# Altium schematic sheet Sheet1.SchDoc
size Letter
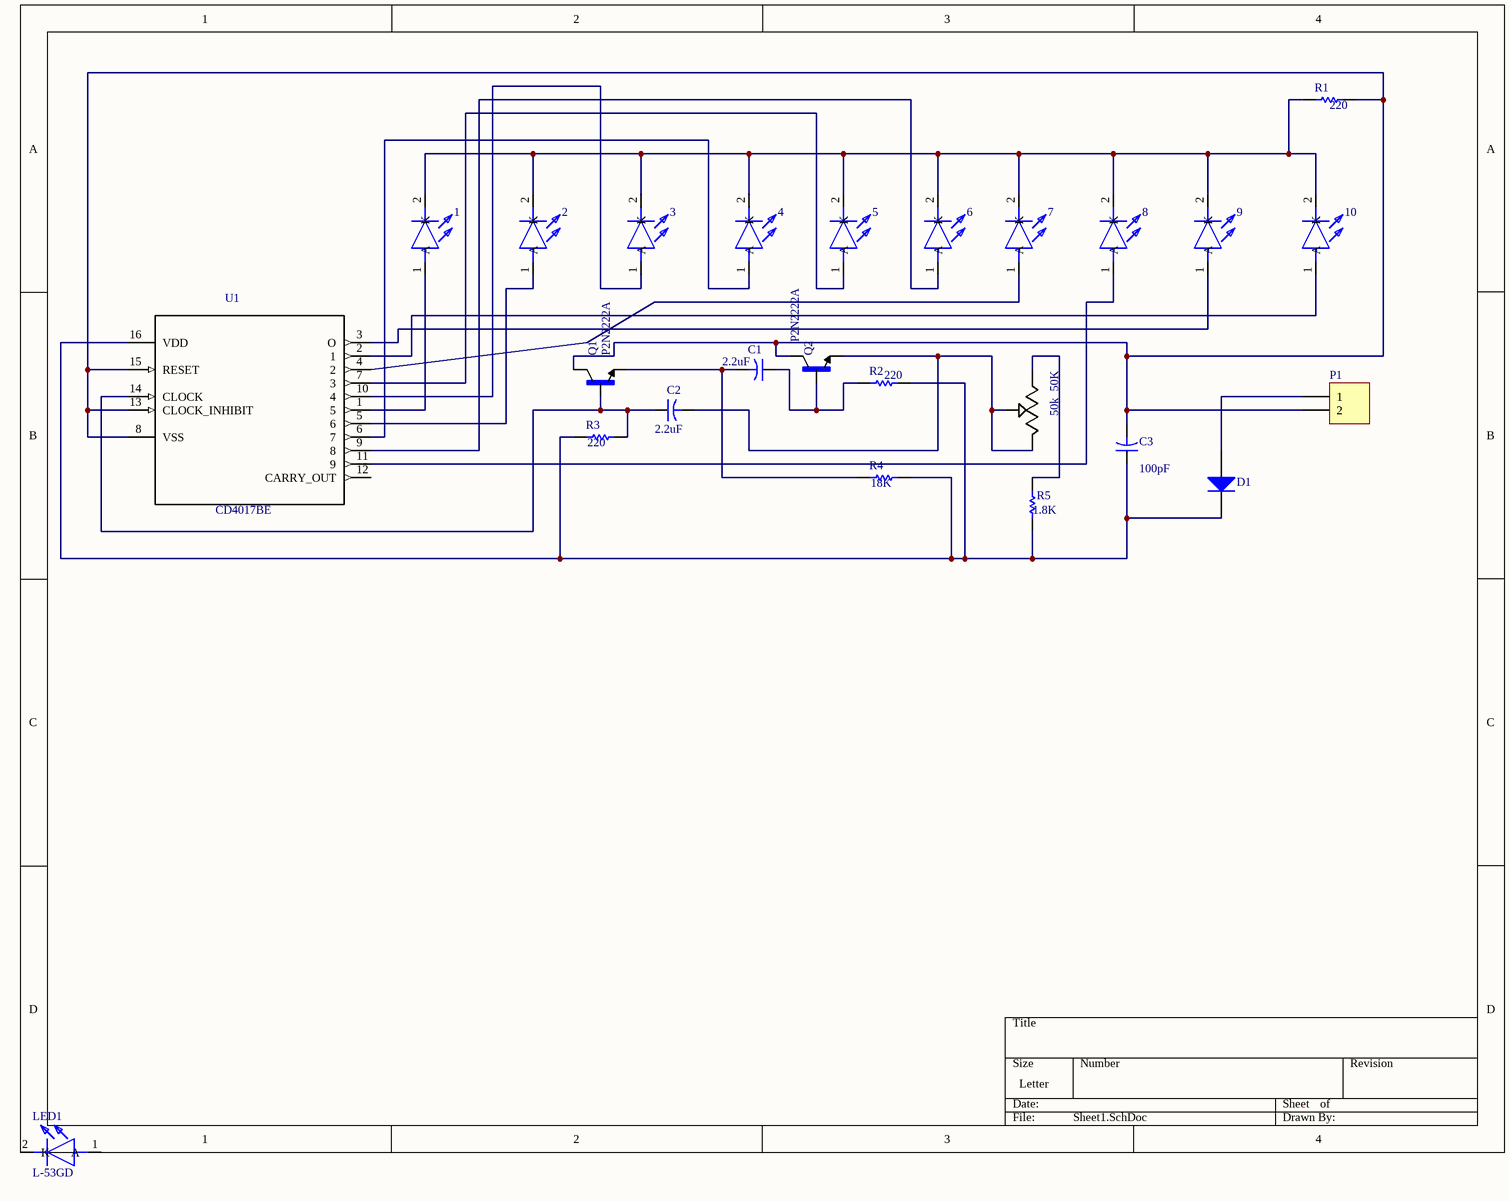
[diagram p0: Sheet1.SchDoc]

## Parts
1  L-53GD  [L-53GD]  (value not drawn)
2  L-53GD  [L-53GD]  (value not drawn)
3  L-53GD  [L-53GD]  (value not drawn)
4  L-53GD  [L-53GD]  (value not drawn)
5  L-53GD  [L-53GD]  (value not drawn)
6  L-53GD  [L-53GD]  (value not drawn)
7  L-53GD  [L-53GD]  (value not drawn)
8  L-53GD  [L-53GD]  (value not drawn)
9  L-53GD  [L-53GD]  (value not drawn)
10  L-53GD  [L-53GD]  (value not drawn)
50k  50K  [*TRIM_EVN-D8AA03B14]
C1  value 2.2uF  [CAPR5-4X5]
C2  value 2.2uF  [CAPR5-4X5]
C3  value 100pF  [CAPR5-4X5]
D1  (no value)  [DO-41]
LED1  L-53GD  [L-53GD]
P1  (no value)  [HDR1X2]
Q1  P2N2222A  [*TO92]
Q2  P2N2222A  [*TO92]
R1  value 220  [AXIAL-0.3]
R2  value 220  [AXIAL-0.3]
R3  value 220  [AXIAL-0.3]
R4  value 18K  [AXIAL-0.3]
R5  value 1.8K  [AXIAL-0.3]
U1  CD4017BE  [*DIP254P762X508-16]

## Nets
Net1_1: 1.1(A) U1.1(5)
Net1_2: 1.2(K) 2.2(K) 3.2(K) 4.2(K) 5.2(K) 6.2(K) 7.2(K) 8.2(K) 9.2(K) 10.2(K) R1.1
Net2_1: 2.1(A) U1.5(6)
Net3_1: 3.1(A) U1.10(4)
Net4_1: 4.1(A) U1.6(7)
Net5_1: 5.1(A) U1.7(3)
Net6_1: 6.1(A) U1.9(8)
Net7_1: 7.1(A) U1.4(2)
Net8_1: 8.1(A) U1.11(9)
Net9_1: 9.1(A) U1.3(O)
Net10_1: 10.1(A) U1.2(1)
Net50k_1: 50k.1 R5.1
Net50k_2: 50k.2 50k.3 C2.2 Q2.1(E)
NetC1_1: C1.1 Q2.2(B) R2.1
NetC1_2: C1.2 Q1.1(E) R4.1
NetC2_1: C2.1 Q1.2(B) R3.2 U1.14(CLOCK)
NetC3_1: C3.1 D1.2(K) R2.2 R3.1 R4.2 R5.2 U1.16(VDD)
NetC3_2: C3.2 P1.2 Q1.3(C) Q2.3(C) R1.2 U1.8(VSS) U1.13(CLOCK_INHIBIT) U1.15(RESET)
NetD1_1: D1.1(A) P1.1

Not connected (* = marked no-connect by the designer): LED1 1(A) 2(K); U1 12(CARRY_OUT)

## Library data of the parts
1-10 LED1 = L-53GD: LED; Manufacturer_Name: Kingbright; Allied_Number: 70424261; Datasheet Link: http://docs-emea.rs-online.com/webdocs/151e/0900766b8151e408.pdf; Manufacturer_Part_Number: L-53GD; Mouser Part Number: N/A; Mouser Price/Stock: https://www.mouser.com/Search/Refine.aspx?Keyword=N%2FA; RS Part Number: 2286004A; RS Price/Stock: http://uk.rs-online.com/web/p/products/2286004A; Allied Price/Stock: http://www.alliedelec.com/kingbright-l-53gd/70424261/
50k = EVN-D8AA03B14: Trimmer; Carbon; Rest 10 Kilohms; PCB; 1 Turn; Pwr-Rtg 0.1 W; Linear; Top Adj; 6 mm SQ; MF: Panasonic Electronic; Availability: Unavailable; Price: None; SnapEDA_Link: https://www.snapeda.com/parts/EVN-D8AA03B14/Panasonic%20Electronic%20Components/view-part/?ref=snap; MP: EVN-D8AA03B14; Package: PQFP-44 Panasonic; Value: *
C1-C3 = Cap2: Capacitor; Published: 23-Sep-2002; PackageReference: CAPR5-4X5; Publisher: Altium Limited; PackageDescription: Capacitor; 2 Leads
D1 = Diode 1N4001: 1 Amp General Purpose Rectifier; Published: 8-Jun-2000; LatestRevisionDate: 17-Jul-2002; LatestRevisionNote: Re-released for DXP Platform.; DatasheetVersion: 1998; PackageVersion: Aug-1999; PackageReference: DO-41; Publisher: Altium Limited; PackageDescription: Diode, Axial; Body 5.2 x 2.7 mm (LxDia. max), Lead Dia. 0.86 mm (max); Code_JEDEC: DO-204-AL; ComponentLink1Description: Manufacturer Link; ComponentLink1URL: http://www.fairchildsemi.com/; ComponentLink2Description: Datasheet; ComponentLink2URL: http://www.fairchildsemi.com/ds/1N%2F1N4001.pdf
P1 = Header 2: Header, 2-Pin; LatestRevisionDate: 17-Jul-2002; LatestRevisionNote: Re-released for DXP Platform.; Publisher: Altium Limited
Q1 Q2 = P2N2222A: MF: ON Semiconductor; SnapEDA_Link: https://www.snapeda.com/parts/P2N2222A/ON%20Semiconductor/view-part/?ref=snap; Availability: Unavailable; Package: TO-92 NXP Semiconductors; Price: None; MP: P2N2222A; Value: *
R1-R5 = Res1: Resistor; Published: 8-Jun-2000; LatestRevisionDate: 17-Jul-2002; LatestRevisionNote: Re-released for DXP Platform.; PackageReference: AXIAL-0.3; Publisher: Altium Limited; PackageDescription: Axial Device, Thru-Hole; 2 Leads; 0.3 in Pin Spacing
U1 = CD4017BE: IC Mos 4017/CD4017BE HARRIS; MF: Texas; SnapEDA_Link: https://www.snapeda.com/parts/CD4017BE/Texas%20Instruments/view-part/?ref=snap; Availability: Unavailable; Price: None; MP: CD4017BE; Package: DIP-16 Intersil; Value: *